# Altium schematic sheet Project_OLIA.SchDoc
size A2; SheetNumber: 1; SheetTotal: 1
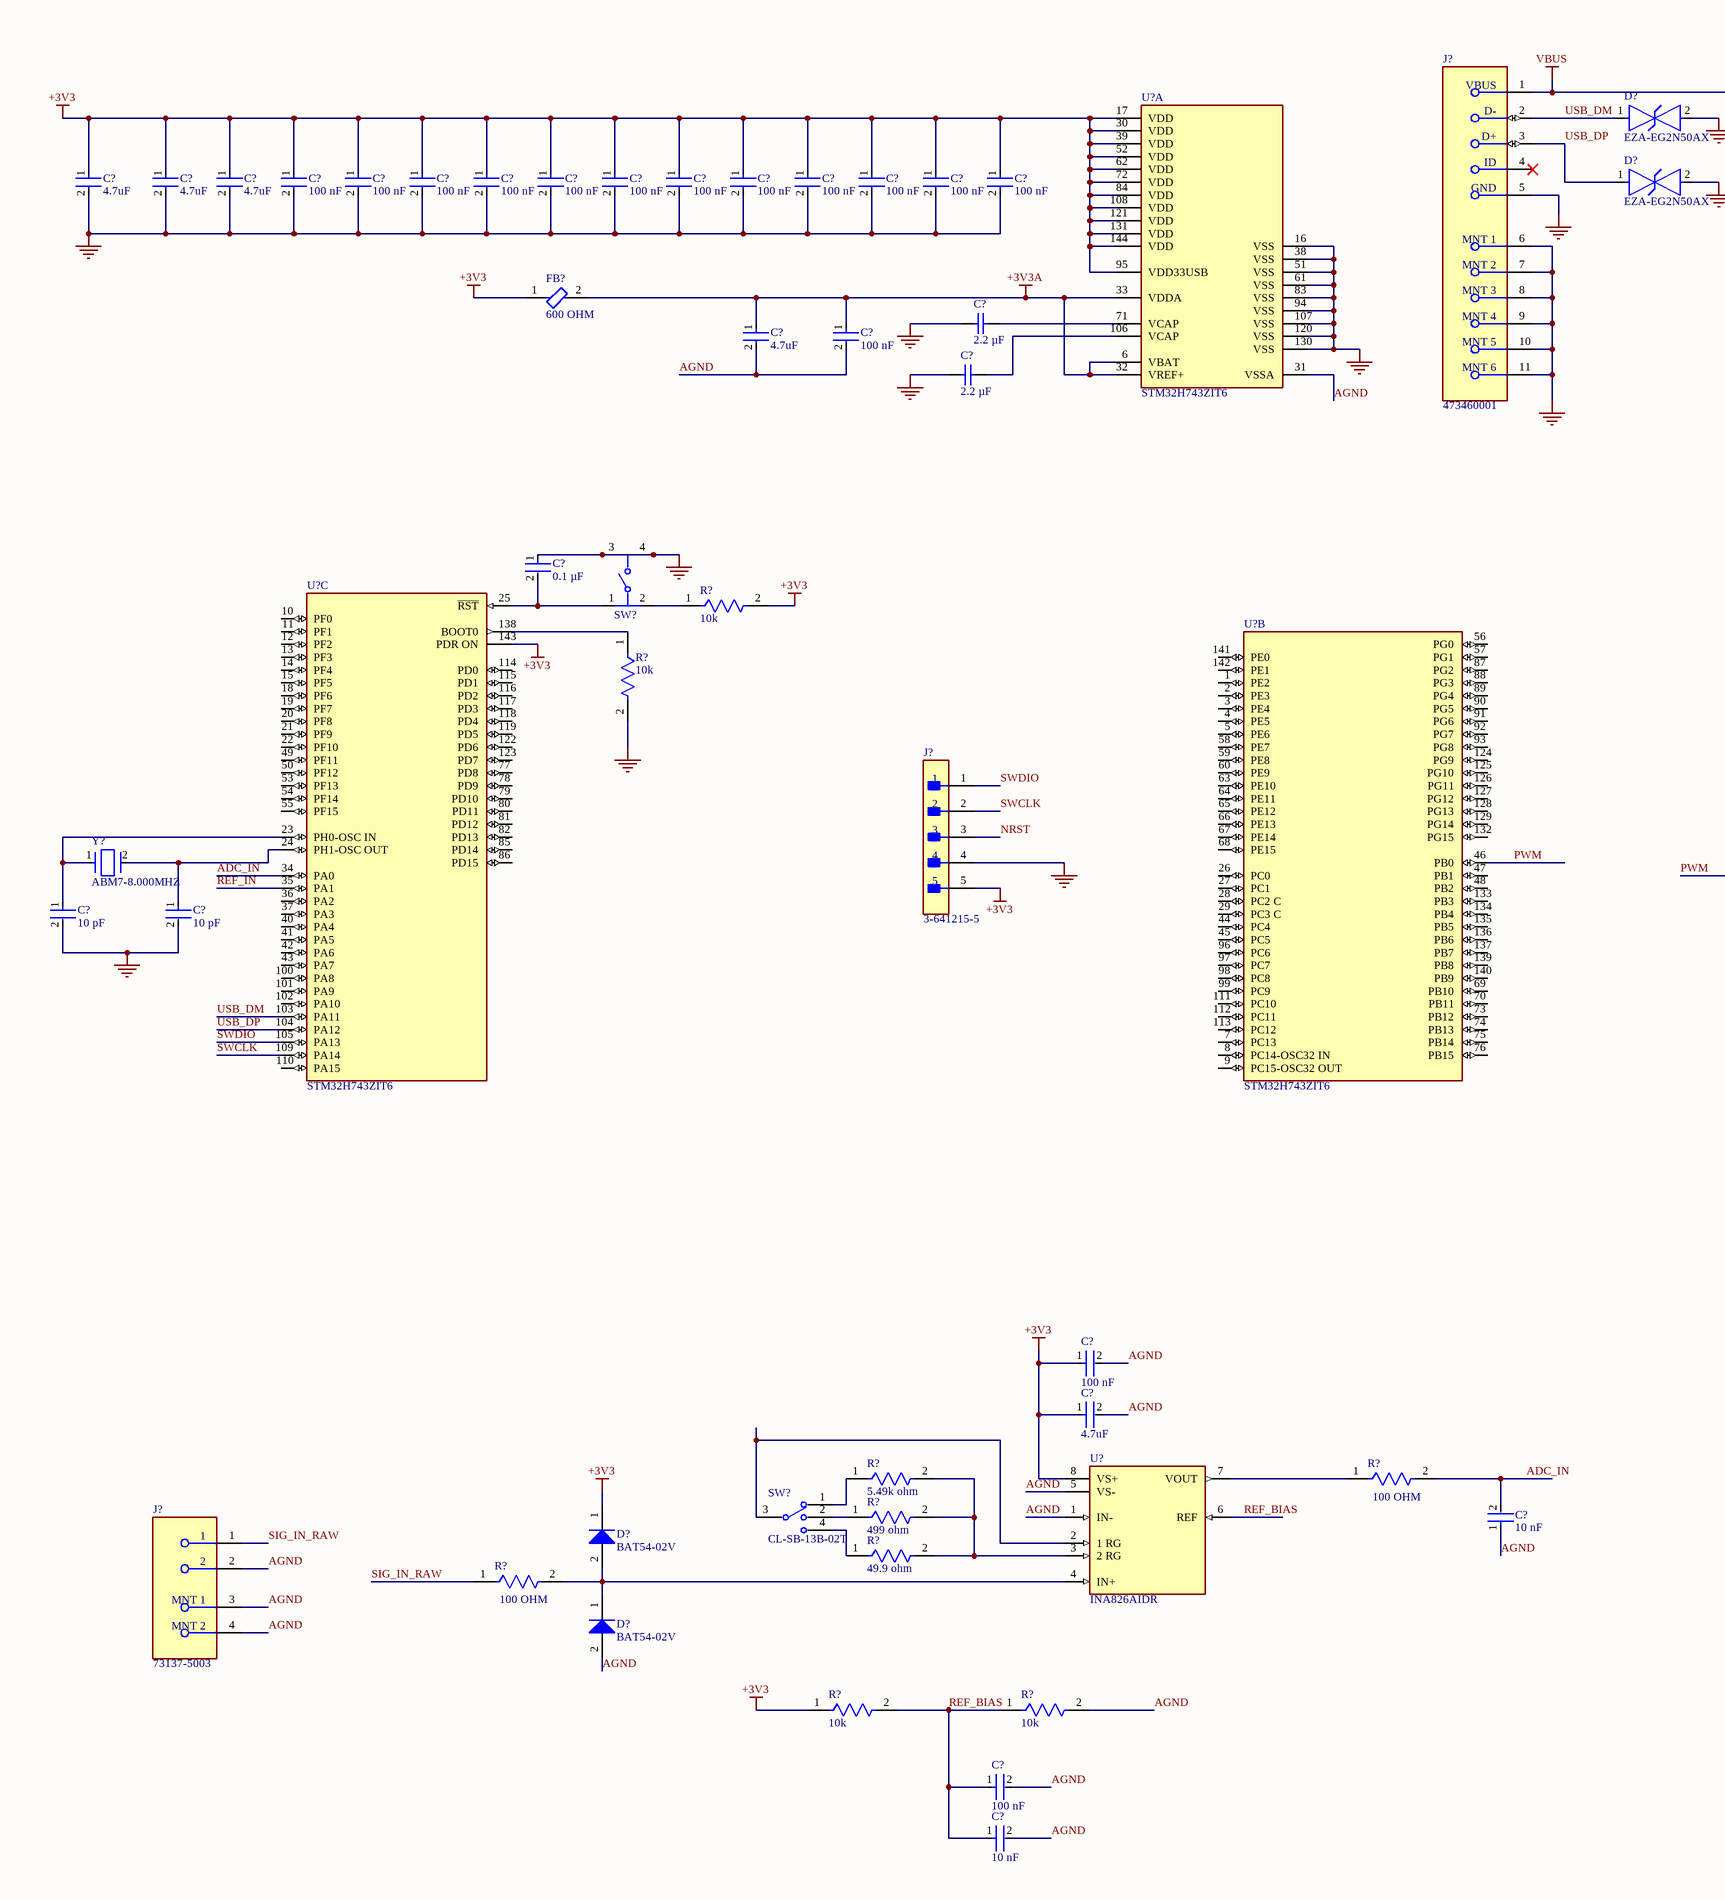
[diagram p0: Project_OLIA.SchDoc, left]
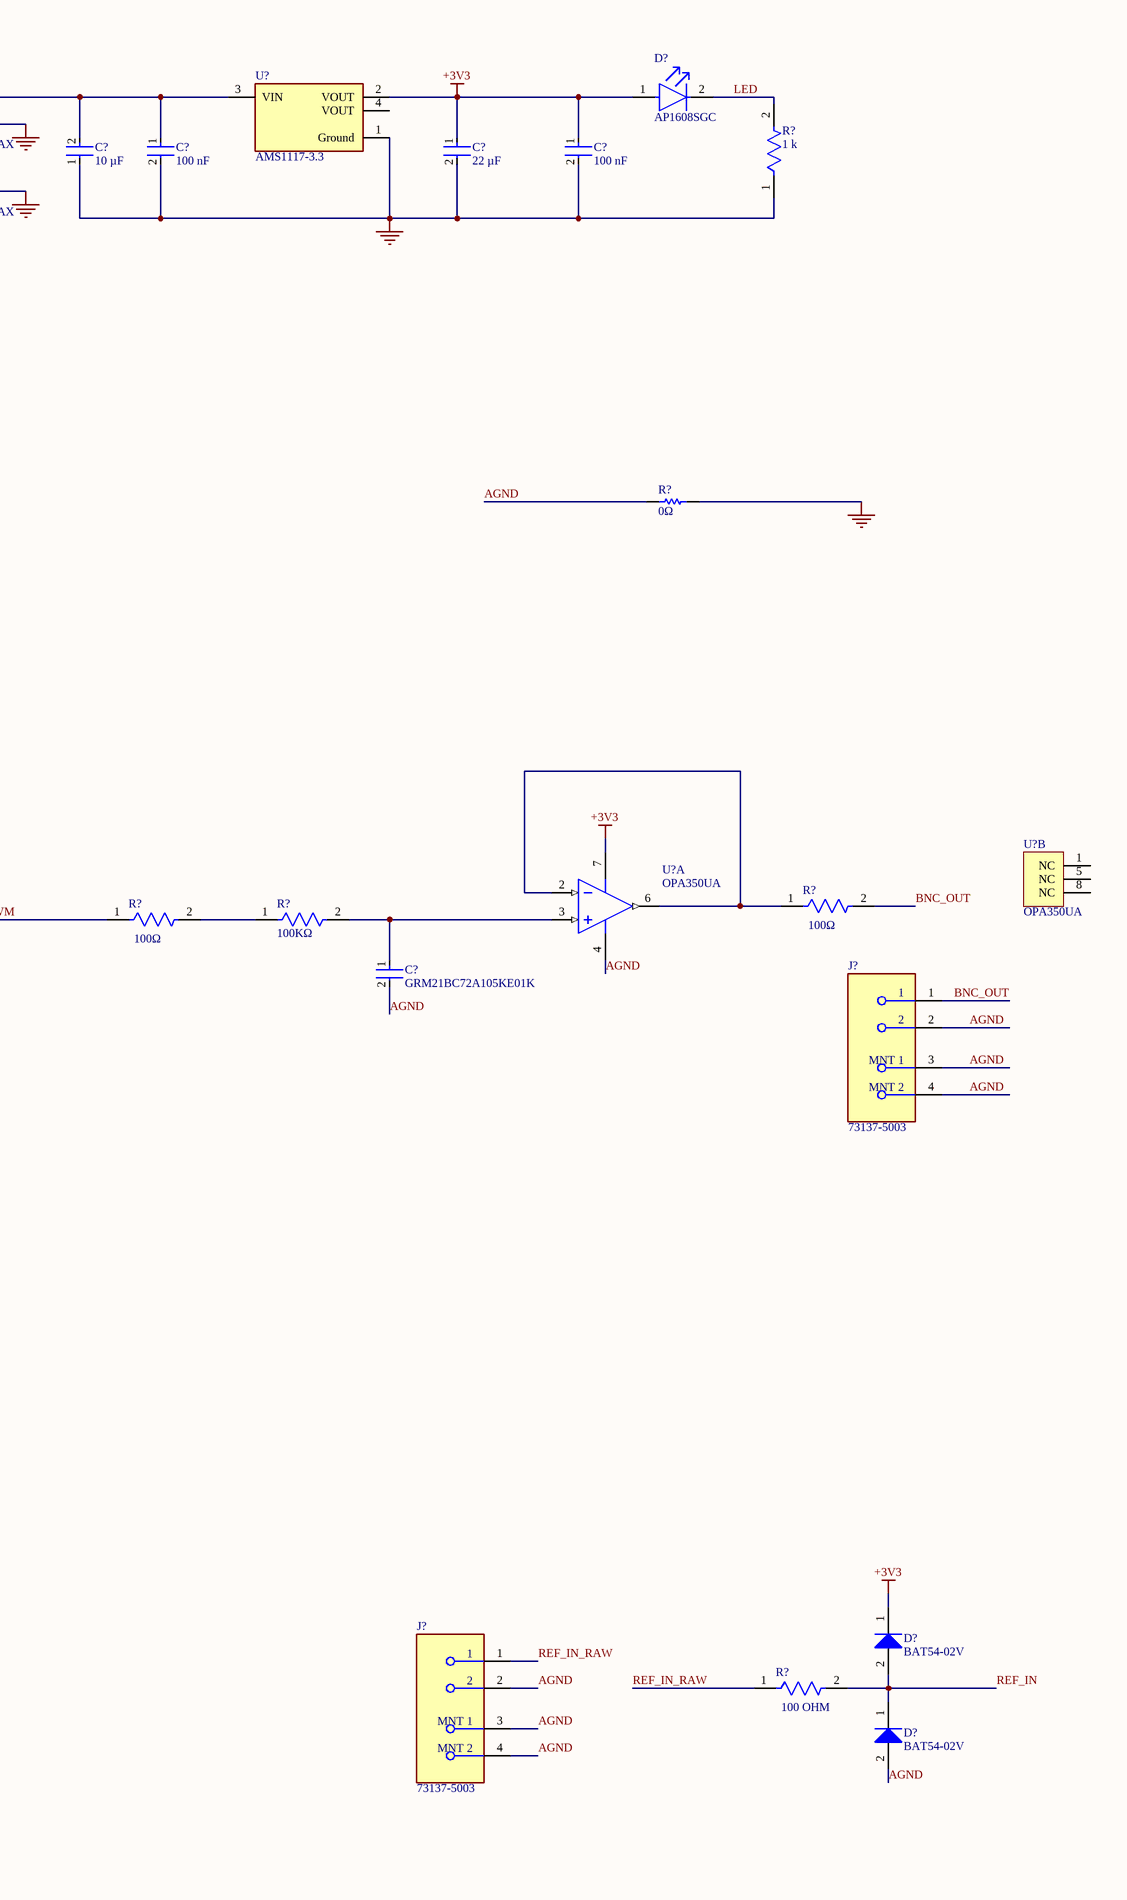
[diagram p1: Project_OLIA.SchDoc, right]

## Parts
(Parts that share a designator on the sheet are numbered #1, #2 ... from top to bottom, then left to right.)
C?#1  10 µF  [FP-GCM32E-0_3-IPC_B]
C?#2  100 nF  [FP-0603B104K500CT-IPC_C]
C?#3  22 µF  [FP-GRM188-0_2-IPC_B]
C?#4  100 nF  [FP-0603B104K500CT-IPC_C]
C?#5  4.7uF  [FP-GRM21B-0_15-IPC_A]
C?#6  4.7uF  [FP-GRM21B-0_15-IPC_A]
C?#7  4.7uF  [FP-GRM21B-0_15-IPC_A]
C?#8  100 nF  [FP-0603B104K500CT-IPC_C]
C?#9  100 nF  [FP-0603B104K500CT-IPC_C]
C?#10  100 nF  [FP-0603B104K500CT-IPC_C]
C?#11  100 nF  [FP-0603B104K500CT-IPC_C]
C?#12  100 nF  [FP-0603B104K500CT-IPC_C]
C?#13  100 nF  [FP-0603B104K500CT-IPC_C]
C?#14  100 nF  [FP-0603B104K500CT-IPC_C]
C?#15  100 nF  [FP-0603B104K500CT-IPC_C]
C?#16  100 nF  [FP-0603B104K500CT-IPC_C]
C?#17  100 nF  [FP-0603B104K500CT-IPC_C]
C?#18  100 nF  [FP-0603B104K500CT-IPC_C]
C?#19  100 nF  [FP-0603B104K500CT-IPC_C]
C?#20  4.7uF  [FP-GRM21B-0_15-IPC_A]
C?#21  100 nF  [FP-0603B104K500CT-IPC_C]
C?#22  2.2 µF  [CAPC0603X33X15ML03T05]
C?#23  2.2 µF  [CAPC0603X33X15ML03T05]
C?#24  0.1 µF  [FP-C0603C-CF-MFG]
C?#25  10 pF  [FP-GJM155-0_05-IPC_B]
C?#26  10 pF  [FP-GJM155-0_05-IPC_B]
C?#27  GRM21BC72A105KE01K  [FP-GRM21B-0_2-e0_2_0_7-MFG]
C?#28  100 nF  [FP-0603B104K500CT-IPC_C]
C?#29  4.7uF  [FP-GRM21B-0_15-IPC_A]
C?#30  10 nF  [FP-GRM033-0_03-IPC_B]
C?#31  100 nF  [FP-0603B104K500CT-IPC_C]
C?#32  10 nF  [FP-GRM033-0_03-IPC_B]
D?#1  AP1608SGC  [FP-AP1608SGC-MFG]
D?#2  EZA-EG2N50AX  [FP-EZAEG2N-MFG]
D?#3  EZA-EG2N50AX  [FP-EZAEG2N-MFG]
D?#4  BAT54-02V  [INF-SC79_V]
D?#5  BAT54-02V  [INF-SC79_V]
D?#6  BAT54-02V  [INF-SC79_V]
D?#7  BAT54-02V  [INF-SC79_V]
FB?  600 OHM  [FP-MMZ1608-0_6-MFG]
J?#1  473460001  [FP-473460001-MFG]
J?#2  3-641215-5  [FP-3-641215-5-MFG]
J?#3  73137-5003  [FP-73137-5003-MFG]
J?#4  73137-5003  [FP-73137-5003-MFG]
J?#5  73137-5003  [FP-73137-5003-MFG]
R?#1  1 k  [FP-RMCF0603-MFG]
R?#2  0Ω  [RESC1609X50X30LL10T20]
R?#3  10k  [FP-RC1005-IPC_B]
R?#4  10k  [FP-RC1005-IPC_B]
R?#5  100Ω  [FP-ERA1A-IPC_B]
R?#6  100Ω  [FP-ERA1A-IPC_B]
R?#7  100KΩ  [FP-AC0603-MFG]
R?#8  5.49k ohm  [FP-CRCW0805-e3-IPC_B]
R?#9  100 OHM  [FP-ERA1A-IPC_B]
R?#10  499 ohm  [FP-CRCW0603-e3-MFG]
R?#11  49.9 ohm  [FP-AC2512-MFG]
R?#12  100 OHM  [FP-ERA1A-IPC_B]
R?#13  100 OHM  [FP-ERA1A-IPC_B]
R?#14  10k  [FP-RC1005-IPC_B]
R?#15  10k  [FP-RC1005-IPC_B]
SW?#1  1-1977223-9  [FP-1-1977223-9-MFG]  (value not drawn)
SW?#2  CL-SB-13B-02T  [FP-CL-SB-13B-02T-MFG]
U?#1  AMS1117-3.3  [FP-AMS1117-IPC_C]
U?#2  STM32H743ZIT6  [FP-LQFP144-1A-MFG]  (part A of 3)
U?#3  STM32H743ZIT6  [FP-LQFP144-1A-MFG]  (part C of 3)
U?#4  STM32H743ZIT6  [FP-LQFP144-1A-MFG]  (part B of 3)
U?#5  OPA350UA  [D0008A_M]  (part B of 2)
U?#6  OPA350UA  [D0008A_M]  (part A of 2)
U?#7  INA826AIDR  [FP-D0008A-IPC_A]
Y?  ABM7-8.000MHZ  [FP-ABM7-MFG]

## Nets
+3V3: C?#3.1 C?#4.1 C?#5.1 C?#6.1 C?#7.1 C?#8.1 C?#9.1 C?#10.1 C?#11.1 C?#12.1 C?#13.1 C?#14.1 C?#15.1 C?#16.1 C?#17.1 C?#18.1 C?#19.1 C?#28.1 C?#29.1 D?#1.1(A) D?#4.1(K) D?#5.1(K) FB?.1 J?#2.5 R?#3.2 R?#14.1 U?#1.2(VOUT) U?#2.17(VDD) U?#2.30(VDD) U?#2.39(VDD) U?#2.52(VDD) U?#2.62(VDD) U?#2.72(VDD) U?#2.84(VDD) U?#2.95(VDD33USB) U?#2.108(VDD) U?#2.121(VDD) U?#2.131(VDD) U?#2.144(VDD) U?#3.143(PDR_ON) U?#6.7(V+) U?#7.8(VS+)
+3V3A: C?#20.1 C?#21.1 FB?.2 U?#2.6(VBAT) U?#2.32(VREF+) U?#2.33(VDDA)
GND: C?#1.1 C?#2.2 C?#3.2 C?#4.2 C?#5.2 C?#6.2 C?#7.2 C?#8.2 C?#9.2 C?#10.2 C?#11.2 C?#12.2 C?#13.2 C?#14.2 C?#15.2 C?#16.2 C?#17.2 C?#18.2 C?#19.2 C?#22.2 C?#23.1 C?#24.1 C?#25.2 C?#26.2 D?#2.2 D?#3.2 J?#1.5(GND) J?#1.6(MNT_1) J?#1.7(MNT_2) J?#1.8(MNT_3) J?#1.9(MNT_4) J?#1.10(MNT_5) J?#1.11(MNT_6) J?#2.4 R?#1.1 R?#2.2 R?#4.2 SW?#1.3 SW?#1.4 U?#1.1(Ground) U?#2.16(VSS) U?#2.38(VSS) U?#2.51(VSS) U?#2.61(VSS) U?#2.83(VSS) U?#2.94(VSS) U?#2.107(VSS) U?#2.120(VSS) U?#2.130(VSS)
VBUS: C?#1.2 C?#2.1 J?#1.1(VBUS) U?#1.3(VIN)
ADC_IN: C?#30.2 R?#9.2 U?#3.34(PA0)
AGND: C?#20.2 C?#21.2 C?#27.2 C?#28.2 C?#29.2 C?#30.1 C?#31.2 C?#32.2 D?#6.2(A) D?#7.2(A) J?#3.2 J?#3.3(MNT_1) J?#3.4(MNT_2) J?#4.2 J?#4.3(MNT_1) J?#4.4(MNT_2) J?#5.2 J?#5.3(MNT_1) J?#5.4(MNT_2) R?#2.1 R?#15.2 U?#2.31(VSSA) U?#6.4(V-) U?#7.1(IN-) U?#7.5(VS-)
BNC_OUT: J?#3.1 R?#5.2
LED: D?#1.2(C) R?#1.2
NRST: J?#2.3
PWM: R?#6.1 U?#4.46(PB0)
REF_BIAS: C?#31.1 C?#32.1 R?#14.2 R?#15.1 U?#7.6(REF)
REF_IN: D?#5.2(A) D?#7.1(K) R?#13.2 U?#3.35(PA1)
REF_IN_RAW: J?#5.1 R?#13.1
SIG_IN_RAW: J?#4.1 R?#12.1
SWCLK: J?#2.2 U?#3.109(PA14)
SWDIO: J?#2.1 U?#3.105(PA13)
USB_DM: D?#2.1 J?#1.2(D-) U?#3.103(PA11)
USB_DP: D?#3.1 J?#1.3(D+) U?#3.104(PA12)
NetC?#22_1: C?#22.1 U?#2.71(VCAP)
NetC?#23_2: C?#23.2 U?#2.106(VCAP)
NetC?#24_2: C?#24.2 SW?#1.1 U?#3.25(~{RST})
NetC?#25_1: C?#25.1 U?#3.23(PH0-OSC_IN) Y?.1
NetC?#26_1: C?#26.1 U?#3.24(PH1-OSC_OUT) Y?.2
NetC?#27_1: C?#27.1 R?#7.2 U?#6.3(IN+)
NetD?#4_2: D?#4.2(A) D?#6.1(K) R?#12.2 U?#7.4(IN+)
NetR?#3_1: R?#3.1 SW?#1.2
NetR?#4_1: R?#4.1 U?#3.138(BOOT0)
NetR?#5_1: R?#5.1 U?#6.2(IN-) U?#6.6(OUT)
NetR?#6_2: R?#6.2 R?#7.1
NetR?#8_1: R?#8.1 SW?#2.1
NetR?#8_2: R?#8.2 R?#10.2 R?#11.2 U?#7.3(2_RG)
NetR?#9_1: R?#9.1 U?#7.7(VOUT)
NetR?#10_1: R?#10.1 SW?#2.2
NetR?#11_1: R?#11.1 SW?#2.4
NetSW?#2_3: SW?#2.3(C) U?#7.2(1_RG)

Not connected (* = marked no-connect by the designer): J?#1 4(ID)*; U?#1 4(VOUT); U?#3 10(PF0) 11(PF1) 12(PF2) 13(PF3) 14(PF4) 15(PF5) 18(PF6) 19(PF7) 20(PF8) 21(PF9) 22(PF10) 36(PA2) 37(PA3) 40(PA4) 41(PA5) 42(PA6) 43(PA7) 49(PF11) 50(PF12) 53(PF13) 54(PF14) 55(PF15) 77(PD8) 78(PD9) 79(PD10) 80(PD11) 81(PD12) 82(PD13) 85(PD14) 86(PD15) 100(PA8) 101(PA9) 102(PA10) 110(PA15) 114(PD0) 115(PD1) 116(PD2) 117(PD3) 118(PD4) 119(PD5) 122(PD6) 123(PD7); U?#4 1(PE2) 2(PE3) 3(PE4) 4(PE5) 5(PE6) 7(PC13) 8(PC14-OSC32_IN) 9(PC15-OSC32_OUT) 26(PC0) 27(PC1) 28(PC2_C) 29(PC3_C) 44(PC4) 45(PC5) 47(PB1) 48(PB2) 56(PG0) 57(PG1) 58(PE7) 59(PE8) 60(PE9) 63(PE10) 64(PE11) 65(PE12) 66(PE13) 67(PE14) 68(PE15) 69(PB10) 70(PB11) 73(PB12) 74(PB13) 75(PB14) 76(PB15) 87(PG2) 88(PG3) 89(PG4) 90(PG5) 91(PG6) 92(PG7) 93(PG8) 96(PC6) 97(PC7) 98(PC8) 99(PC9) 111(PC10) 112(PC11) 113(PC12) 124(PG9) 125(PG10) 126(PG11) 127(PG12) 128(PG13) 129(PG14) 132(PG15) 133(PB3) 134(PB4) 135(PB5) 136(PB6) 137(PB7) 139(PB8) 140(PB9) 141(PE0) 142(PE1); U?#5 1(NC) 5(NC) 8(NC)

## Library data of the parts
C?#1 = CMP-2000-06321-2: Ceramic Capacitor for Automotive 10uF ±10% 25VDC X7R 1210 Embossed T/R; Voltage: 25V; Thickness: 0.106inch; Min Operating Temperature: -55°C; Max Operating Temperature: 125°C; Ratings: AEC-Q200; Packaging: Tape and Reel; Package Quantity: 1; Width: 2.5mm; Mount: Surface Mount; Height: 2.5mm; Case Code (Imperial): 1210; Length: 3.2mm; Capacitance: 10uF; Tolerance: 10%; Lead Free: Lead Free; Dielectric: X7R; REACH SVHC: No SVHC; Case/Package: 1210; Voltage Rating: 25V; Depth: 2.5mm; Case Code (Metric): 3225; Termination: SMD/SMT; Voltage Rating (DC): 25V; Radiation Hardening: No
C?#2 C?#4 C?#8-C?#19 C?#21 C?#28 C?#31 = CMP-45632-000007-1: CAP CER 0.1UF 50V X7R 0603; Tolerance: 10%; Capacitance: 100nF; Radiation Hardening: No; Depth: 0.8mm; Length: 1.6mm; Voltage Rating: 50V; Dielectric: X7R; Case/Package: 0603; RoHS Compliant: Yes; Case Code (Metric): 1608; Voltage Rating (DC): 50V; Min Operating Temperature: -55°C; Series: -; Max Operating Temperature: 125°C; Lead Free: Lead Free; Case Code (Imperial): 0603; Packaging: Tape and Reel
C?#3 = CMP-06035-000956-1: Chip Multilayer Ceramic Capacitors for General Purpose, 0603, 22uF, X5R, 15%, 20%, 10V; Tolerance: 20%; Voltage Rating (DC): 10V; Length: 1.6mm; Thickness: 800um; Width: 800um; Dielectric: X5R; Capacitance: 22uF
C?#5-C?#7 C?#20 C?#29 = CMP-06035-033280-1: Chip Multilayer Ceramic Capacitors for General Purpose, 0805, 4.7uF, X6S, 22%, 20%, 35V; Length: 2mm; Dielectric: X6S; Width: 1.25mm; Capacitance: 4.7uF; Case/Package: 0805; Tolerance: 20%; Voltage Rating (DC): 35V; Thickness: 1.25mm
C?#22 C?#23 = CMP-2010-00434-1: Manufacturer: AVX Interconnect / Elco; Part Number: 0201ZD225MAT2A
C?#24 = CMP-2006-03061-2: CAP CER 0.1UF 50V X7R 0603; Manufacturer: KEMET; Manufacturer Part Number: C0603C104K5RACTU; Tolerance: 0.1; Temperature Coefficient: 30ppm/°C; Material: Ceramic; Automotive Grade: Grade 1; Value: 0.10 μF; Temperature: -55°C to +125°C; RoHS: TRUE; Temperature Range High: +125°C; Lead Free: Yes; Octopart: https://octopart.com/c0603c104k5ractu-kemet-139244; Digikey Description: CAP CER 0.1UF 50V X7R 0603; Category: Cap; Package: C0603C-CF; ComponentLink2Description: Datasheet; Temperature Range Low: -55°C; Device Class L1: Passive Components; Voltage Rating: 50 V; Automotive: Yes; Device Class L3: Ceramic Capacitors; ComponentLink2URL: https://api.kemet.com/component-edge/download/datasheet/C0603C100J5GACAUTO.pdf; Capacitance: 0.10 μF; Device Class L2: Capacitors; Temperature Characteristic: X7R; Height: 0.87mm
C?#25 C?#26 = CMP-2008-03796-2: Multi-Layer Ceramic Capacitor 10pF C0G  ±2% 0402 Paper T/R; Voltage Rating: 50V; Thickness: 0.022inch; Case Code (Imperial): 0402; Height: 0.5mm; Min Operating Temperature: -55°C; Lead Free: Lead Free; Case Code (Metric): 1005; Mount: Surface Mount; Voltage Rating (DC): 50V; Width: 0.5mm; Max Operating Temperature: 125°C; Case/Package: 0402; Capacitance: 10pF; Packaging: Tape and Reel; Depth: 0.5mm; Package Quantity: 1; Termination: SMD/SMT; Length: 1mm; Dielectric: C0G; Tolerance: 2%; Radiation Hardening: No
C?#27 = CMP-06035-022504-1: Chip Multilayer Ceramic Capacitors for General Purpose, 0805, 1.0uF, X7S, 22%, 10%, 100V; Capacitance: 1uF; Width: 1.25mm; Dielectric: X7S; Length: 2mm; Thickness: 1.25mm; Voltage Rating (DC): 100V; Tolerance: 10%
C?#30 C?#32 = CMP-06035-052966-1: Chip Multilayer Ceramic Capacitors for General Purpose, 0201, 10000pF, X5R, 15%, 10%, 6.3V
D?#1 = CMP-44529-000023-1: Standard LEDs - SMD GREEN WATER CLEAR; Luminous Intensity: 15mcd; Wavelength: 568nm; Forward Voltage: 2.2V; Forward Current: 20mA; Viewing Angle: 120°; Min Operating Temperature: -40°C; Mount: Surface Mount; Case/Package: 0603; Package Quantity: 2000; Lens Style: Clear; Illumination Color: Green; Packaging: Tape and Reel; Color: Green; Lead Free: Lead Free; Lens Color: Clear; Max Operating Temperature: 85°C
D?#2 D?#3 = CMP-00287-77741802-1: EZA-EG2N50AX Esd Suppressor, 50V, 0402 Rohs Compliant: Yes; Direction: Bidirectional; Capacitance: 50fF; Reverse Standoff Voltage: 30V; Case/Package: 0402; Min Operating Temperature: -55°C; Height: 430µm; RoHS: Non-Compliant; Lifecycle Status: Production; Max Operating Temperature: 125°C; Schedule B: 8536300000, 8536300000
D?#4-D?#7 = CMP-1182-00001-1: Silicon Schottky Diode, SC79, Reel, Green; Manufacturer: Infineon; Green: TRUE; ComponentLink3Description: Package Specification; ComponentLink2Description: Datasheet; ComponentLink1Description: Manufacturer URL; PackageDescription: 2-Pin Semiconductor Package, 0.8 x 1.2 mm Body; RevisionNote: Re-Activated Devices; PartNumber: BAT54-02V; ComponentLink3URL: http://www.infineon.com/dgdl/SC79-Package_Overview.pdf?folderId=db3a30431936bc4b011951fbddb03b15&fileId=db3a30431936bc4b01195226fe583b41; PackageReference: SC79; ComponentLink1URL: http://www.infineon.com/; ComponentLink2URL: http://www.infineon.com/dgdl/bat54series.pdf?folderId=db3a30431400ef68011425f1ca2505e3&fileId=db3a304314dca3890115190b74210ea6; Mounting Technology: Surface Mount; Halogen-free: FALSE
FB? = CMP-08257-000287-1: Signal Line Ferrite Bead 600 Ω 100MHz 500mA DCR 400mΩ AEC-Q200 SMD 0603; Impedance: 600R; Number of Lines: 1; DC Resistance (DCR): 400mR; Tolerance: 25%; Package Quantity: 1; RoHS Compliant: Yes; Case/Package: 0603; Width: 0.031inch; Test Frequency: 100MHz; Length: 0.063inch; Weight: 7.1E-05oz; Packaging: Tape and Reel; Max Current Rating: 500mA; Min Operating Temperature: -55°C; Ratings: AEC-Q200; Max Operating Temperature: 125°C; Termination: SMD/SMT; Case Code (Metric): 1608; Mount: Surface Mount; Height: 0.03inch; Case Code (Imperial): 0603; Max DC Current: 500mA
J?#1 = CMP-2000-05246-2: CONN RCPT USB2.0 MICRO B SMD R/A; Manufacturer: Molex; Conn Orientation: Right Angle; Is Female: yes; Shielding: true; Pitch: 0.65mm; Number Of Contacts: 5; Voltage Rating: 30V; Current Rating: 1.8A; Device Class L2: USB Connectors; Digikey Description: CONN RCPT USB2.0 MICRO B SMD R/A; Height: 2.945mm; RoHS: TRUE; ComponentLink2Description: Datasheet; Octopart: https://octopart.com/47346-0001-molex-7164928; Automotive: No; Package: 0; Category: Conn; Device Class L1: Connectors; Usb Standard: USB 2.0; Temperature: -30°C to +85°C; Temperature Range Low: -30°C; Footprint Url: https://www.molex.com/pdm_docs/sd/473460001_sd.pdf; ComponentLink2URL: https://www.molex.com/webdocs/datasheets/pdf/en-us/0473460001_IO_CONNECTORS.pdf; Lead Free: Yes; Manufacturer Part Number: 473460001; Contact Material: Gold,Nickel; Temperature Range High: +85°C; Device Class L3: unset
J?#2 = CMP-03369-000062-1: CONN HEADER VERT 5POS 2.54MM; Manufacturer: TE Connectivity; Voltage Rating: 250V; Conn Gender: Male; Conn Orientation: Vertical; Current Rating: 5A; Number Of Contacts: 5; Device Class L3: unset; Package: 3-641215-5; Digikey Description: CONN HEADER VERT 5POS 2.54MM; Device Class L1: Connectors; Temperature: -55°C to +105°C; Manufacturer Part Number: 3-641215-5; Pitch: 2.54mm; RoHS: TRUE; ComponentLink2Description: Datasheet; Footprint Url: https://www.te.com/commerce/DocumentDelivery/DDEController?Action=showdoc&DocId=Customer+Drawing%7F641215%7FZ4%7Fpdf%7FEnglish%7FENG_CD_641215_Z4.pdf%7F3-641215-5; Height: 0.415inch; Temperature Range High: +105°C; Mouser Description: Headers & Wire Housings FRICTION LCK HDR 5P Straight Post gold; Automotive: No; Number Of Rows: 1; Device Class L2: Headers and Wire Housings; Contact Material: Gold,Nickel; Temperature Range Low: -55°C; ComponentLink2URL: https://www.te.com/commerce/DocumentDelivery/DDEController?Action=showdoc&DocId=Specification+Or+Standard%7F108-1050%7FL%7Fpdf%7FEnglish%7FENG_SS_108-1050_L.pdf%7F3-641215-5; Octopart: https://octopart.com/3-641215-5-te+connectivity-40938285; Category: Conn; Lead Free: Yes
J?#3-J?#5 = CMP-00257-00776508-1: 73137-5003 Connector BNC Female 0Hz To 2GHz 50 Ohm Solder Right Angle Through Hole Gold Tray; NexarPartId: 776508; Manufacturer Lifecycle Status: ACTIVE; Body Plating: Nickel; Polarity: Normal; Connector Type: PCB; Number of Contacts: 1; Impedance: 50Ω; Body Material: PBT, Polybutylene; Voltage Rating: 500V; Dielectric Material: Polypropylene; Min Operating Temperature: -20°C; Orientation: Right Angle, Straight; Termination: Solder; Gender: Female; RoHS: Compliant; REACH SVHC: No SVHC; Lifecycle Status: Production; Country of Origin: US; Contact Plating: Gold; Depth: 14.76mm; Lead Free: Lead Free; Mount: Through Hole; Length: 35.18mm; Max Operating Temperature: 70°C; Frequency: 2GHz; Radiation Hardening: No; Height: 13.2mm; Plating: Nickel; Contact Material: Bronze, Gold, Nickel, Tin; Insulation Material: Polyester; Halogen Free: Low Halogen
R?#1 = CMP-26527-000152-1: 1kΩ ±1% 0.1W 0603 Thick Film Chip Resistor AEC-Q200 compliant; Resistance: 1kR; Max Power Dissipation: 100mW; Temperature Coefficient: 100ppm/°C; Packaging: Tape and Reel; Mount: Surface Mount; RoHS Compliant: Yes; Construction: Rectangular; Width: 0.031inch; Case Code (Imperial): 0603; Contact Plating: Tin; Length: 1.55mm; Lead Free: Lead Free; Case Code (Metric): 1608; Size Code: 0603; Depth: 0.8mm; Series: RMCF; Power Rating: 100mW; Height: 0.022inch; Case/Package: 0603; Tolerance: 1%; Min Operating Temperature: -55°C; Military Standard: Not; Features: Automotive AEC-Q200; Max Operating Temperature: 155°C; Number of Terminations: 2; Radiation Hardening: No; Resistor Type: Thick Film
R?#2 = CMP-1012-00001-2: Manufacturer: Vishay Dale; Part Number: CRCW06030000Z0EC
R?#3 R?#4 R?#14 R?#15 = CMP-13261-004522-1: Res Thick Film 0402 10kΩ 1% 0.063W ±100ppm/°C Molded SMD T/R; Max Power Dissipation: 63mW; Resistance: 10kR; Power Rating: 62.5mW; Package Quantity: 1; Depth: 0.5mm; Radiation Hardening: No; Features: Moisture Resistant; Max Operating Temperature: 155°C; Case Code (Metric): 1005; Military Standard: Not; Case/Package: 0402; Width: 0.02inch; Contact Plating: Tin; Mount: Surface Mount; Packaging: Tape and Reel; Height: 0.016inch; Case Code (Imperial): 0402; Number of Terminations: 2; Composition: Thick Film; Temperature Coefficient: 100ppm/°C; Min Operating Temperature: -55°C; Tolerance: 1%; Length: 1mm
R?#5 R?#6 R?#9 R?#12 R?#13 = CMP-05422-000095-1: RES SMD 100 OHM 0.1% 1/20W 0201; Max Power Dissipation: 50mW; Resistance: 100R; Temperature Coefficient: 25ppm/°C; Lead Free: Lead Free; Width: 0.012inch; Max Operating Temperature: 155°C; Features: Automotive AEC-Q200; Packaging: Tape and Reel; Length: 0.024inch; Number of Terminations: 2; Case Code (Imperial): 0201; Case/Package: 0201; Case Code (Metric): 0603; Tolerance: 0.1%; Min Operating Temperature: -55°C; Height: 0.009inch; Resistor Type: Thin Film
R?#7 = CMP-03412-022575-2: RES 100KΩ 1.00% 0.1W 0603; Tolerance: 1%; Resistance: 100kR; RoHS Compliant: Yes; Case/Package: 0603
R?#8 = CMP-2001-04029-2: RES Thick Film, 5.49kΩ, 1%, 0.125W, 100ppm/°C, 0805; Voltage Rating: 150V; Power Rating: 125mW; Resistance: 5.49kR; Number of Terminations: 2; Packaging: Tape and Reel; Case/Package: 0805; Width: 0.049inch; Case Code (Imperial): 0805; Case Code (Metric): 2012; Radiation Hardening: No; Length: 2mm; Depth: 1.25mm; Tolerance: 1%; Features: Automotive AEC-Q200; Weight: 0.000194oz; Max Operating Temperature: 155°C; Termination: SMD/SMT; Composition: Thick Film; Military Standard: Not; Max Power Dissipation: 125mW; Temperature Coefficient: 100ppm/°C; Height: 0.45mm; Min Operating Temperature: -55°C; Contact Plating: Tin; Package Quantity: 10
R?#10 = CMP-2000-03390-2: RES Thick Film, 499Ω, 1%, 0.1W, 100ppm/°C, 0603; Voltage Rating (DC): 75V; Power Rating: 100mW; Resistance: 499R; Case/Package: 0603; Package Quantity: 5000; Military Standard: Not; Length: 1.55mm; Width: 0.85mm; Number of Terminations: 2; Lead Free: Lead Free; Height: 0.45mm; Weight: 7.1E-05oz; Composition: Thick Film; Radiation Hardening: No; Max Operating Temperature: 155°C; Tolerance: 1%; Working Voltage: 75V; Temperature Coefficient: 100ppm/°C; Packaging: Tape and Reel; Contact Plating: Tin; Termination: SMD/SMT; Depth: 0.85mm; Case Code (Metric): 1608; Min Operating Temperature: -55°C; Mount: Surface Mount; Case Code (Imperial): 0603; Voltage Rating: 75V
R?#11 = CMP-03412-029457-1: RES SMD 49.9 OHM 1% 1W 2512; Manufacturer: Yageo; Manufacturer Part Number: AC2512FK-0749R9L; Automotive Grade: Grade 0; Voltage Rating: 200V; Resistance: 49.9Ω; Tolerance: 0.01; Value: 49.9Ω; Category: Res; Power Rating: 1W; ComponentLink2Description: Datasheet; Device Class L2: Resistors; ComponentLink2URL: http://www.yageo.com/documents/recent/PYu-AC_51_RoHS_L_6.pdf; Footprint Url: http://www.yageo.com/exep/pages/download/literatures/PYu-R_Mount_10.pdf; Lead Free: Yes; Ipc Land Pattern Name: RESC635310X55; Automotive: Yes; Device Class L3: Chip SMD Resistors; Composition: Thick Film; Series: AC; Temperature: -55°C to +155°C; Temperature Range Low: -55°C; Octopart: https://octopart.com/ac2512fk-0749r9l-yageo-71370116; Package: AC2512; RoHS: TRUE; Digikey Description: RES SMD 49.9 OHM 1% 1W 2512; Device Class L1: Passive Components; Height: 0.65mm; Temperature Range High: +155°C
SW?#1 = CMP-03407-000015-1: SWITCH TACTILE SPST-NO 0.05A 24V; Current Rating: 50mA; Operating Force: 2.55N; Throw Configuration: SPST; Actuator Material: Nylon; Actuator Color: Pink; Mechanical Life: 1000000Cycles; Illumination Type: Non-Illuminated; Switch Travel: 0.25mm; Switch Function: Off-Mom; Actuator Type: Standard; RoHS Compliant: Yes; Min Operating Temperature: -40°C; Contact Plating: Silver; Max Operating Temperature: 105°C; Contact Material: Stainless Steel; Max Current Rating: 50mA; Series: FSMJSMA; Length: 6mm; Radiation Hardening: No; Depth: 10mm; Max Voltage Rating (DC): 24V; Orientation: Straight; Termination: Gull Wing; Voltage Rating (DC): 24V; Packaging: Bulk; Mount: Surface Mount; Case/Package: SMD/SMT; Package Quantity: 750
SW?#2 = CMP-08360-77011255-1: CL-SB-13B-02T Switch Slide ON-ON-ON SP3T Top 200mA 12VDC 10000Cycles Gullwing T/R; Actuator Length: 2mm; Contact Style: Non-Shorting; Electrical Life: 10kcycles; Contact Resistance: 70mΩ; Voltage Rating (DC): 12V; Actuator Material: Nylon, Polyamide; RoHS: Compliant; Contact Current Rating: 200mA; Packaging: Tape & Reel (TR); Termination: Gull Wing; Orientation: Vertical; Lead Free: Lead Free; Current Rating: 200mA; Mount: Surface Mount; Height: 6.1mm; Switch Travel: 2mm; Switch Function: On-On-On; Contact Plating: Gold; Min Operating Temperature: -40°C; Throw Configuration: SP3T; Life (Cycles): 10kcycles; NexarPartId: 77011255; Contact Material: Copper; Max Operating Temperature: 85°C
U?#1 = CMP-209535-000001-1: LDO Voltage Regulators 1A, 3.3V; Manufacturer: Advanced Monolithic Systems; Dropout Voltage: 1.1V; Output Type: Fixed; Nominal Supply Current: 5mA; Max Power Dissipation: 1.2W; Max Supply Voltage: 15V; Number Of Outputs: 1; Standoff Height: 0.64mm; Max Junction Temp: +125°C; Height: 1.8mm; Package: AMS1117; Device Class L2: Power Management ICs; ComponentLink2Description: Datasheet; ComponentLink2URL: http://www.advanced-monolithic.com/pdf/ds1117.pdf; Category: IC; RoHS: TRUE; Automotive: No; Device Class L1: Integrated Circuits (ICs); Output Current: 1A; Device Class L3: Voltage Regulators - Linear; Temperature: -40°C to +125°C; Output Voltage: 3.3V; Manufacturer Part Number: AMS1117-3.3; Temperature Range Low: -40°C; Octopart: https://octopart.com/ams1117-3.3-advanced+monolithic+systems-25899300; Lead Free: Yes; Ipc Land Pattern Name: SOT229P700X180-4; Temperature Range High: +125°C
U?#2-U?#4 = CMP-12105-000003-1: IC MCU 32BIT 2MB FLASH 144LQFP; Manufacturer: STMicroelectronics; Number Of I2C Channels: 4; Number Of A/D Converters: 2; Standoff Height: 0.05mm; Interface: I2C,SPI,UART,USART,EBI/EMI,CAN,USB,LIN,IrDA,Other; Max Supply Voltage: 3.6V; Number Of Adc Channels: 36; Ram Size: 1MBytes; Number Of Cores: 1; Frequency: 400MHz; Data Bus Width: 32bits; Core Architecture: ARM Cortex-M7; Memory Size: 2MBytes; Number Of Timers/Counters: 22; Min Supply Voltage: 1.62V; Number Of Spi Channels: 6; Max Junction Temp: +125°C; Number Of I/Os: 114; Digikey Description: IC MCU 32BIT 2MB FLASH 144LQFP; Device Class L2: Embedded Processors and Controllers; Number Of Usb Channels: 2; ComponentLink2Description: Datasheet; Ipc Land Pattern Name: QFP50P2200X2200X160-144; Category: IC; Lead Free: Yes; Temperature Range High: +85°C; Mouser Description: MCU 32-Bit STM32 ARM Cortex M7 RISC 2MB Flash 1.8V/2.5V/3.3V 144-Pin LQFP Tray; RoHS: TRUE; Ambient Temperature Range Low: -40°C; Temperature Range Low: -40°C; ComponentLink2URL: https://www.st.com/resource/en/datasheet/stm32h743zi.pdf; Ambient Temperature Range High: +85°C; Octopart: https://octopart.com/stm32h743zit6-stmicroelectronics-76372529; Number Of Pwm Channels: 2; Height: 1.6mm; Manufacturer Part Number: STM32H743ZIT6; Device Class L3: Microcontrollers; Device Class L1: Integrated Circuits (ICs); Automotive: No; Memory Type: FLASH; Number Of Uart Channels: 4; Package: LQFP144-1A; Temperature: -40°C to +85°C
U?#5 U?#6 = CMP-0271-00145-3: High-Speed, Single-Supply, Rail-to-Rail Operational Amplifier MicroAmplifier(TM) Series, 2.7 to 5.5 V, -40 to 85 degC, 8-pin SOIC (D8), Green (RoHS & no Sb/Br); Manufacturer: Texas Instruments; IIB(Max)(pA): 10; Iq per channel(Max)(mA): 8.5; Number of Channels: 1; CMRR(Min)(dB): 66; Slew Rate(Typ)(V/us): 22; Total Supply Voltage(Max)(+5V is 5, +/-5V is 10): 5.5; Sub Family: Low Input Bias Current Amp (<=10pA), Low Offset Voltage Amplifier (<=500uV), Low Supply Voltage Amplifier (<=2.7V), Precision Amplifier; Offset Drift(Typ)(uV/C): 4; Total Supply Voltage(Min)(+5V is 5, +/-5V is 10): 2.7; Vn at 1kHz(Typ)(nV/rtHz): 18; PackageReference: D0008A; PackageDescription: 8-Pin Plastic Small Outline, Body 4.9 x 3.9 mm, Pitch 1.27 mm; Code_JEDEC: MS-012; Eco-Plan: Green (RoHS & no Sb/Br); DatasheetVersion: SBOS099C; Vio (25C)(Max)(mV): 1; ComponentLink1URL: http://www.ti.com/; ComponentLink3URL: http://www.ti.com/litv/pdf/msoi002j; PackageVersion: 4040047-3/M, 06/2011; ComponentLink3Description: Package Specification; ComponentLink2URL: http://www.ti.com/general/docs/lit/getliterature.tsp?genericPartNumber=OPA350&fileType=pdf; PartNumber: OPA350UA; ComponentLink2Description: Datasheet; ComponentLink1Description: Manufacturer URL; Mounting Technology: Surface Mount
U?#7 = CMP-0944-00042-3: IC INST AMP 1 CIRCUIT 8SOIC; Number of Circuits: 1; Common Mode Rejection Ratio: 84dB; Power Supply Rejection Ratio (PSRR): 100dB; Input Voltage Noise Density: 18nV/sqrt Hz; Input Resistance: 100kR; Output Current per Channel: 16mA; Input Offset Voltage (Vos): 150uV; Bandwidth: 1MHz; Supply Current: 200uA; Input Bias Current: 65nA; Max Dual Supply Voltage: 18V; Max Supply Voltage: 36V; Min Supply Voltage: 2.7V; Voltage Gain: 60dB; Slew Rate: 1V/µs; Min Dual Supply Voltage: 1.35V; Number of Elements: 1; Series: -; Number of Pins: 8; Lead Free: Lead Free; Output Current: 16mA; REACH SVHC: No SVHC; Min Operating Temperature: -40°C; Quiescent Current: 200uA; Nominal Supply Current: 200uA; Max Operating Temperature: 125°C; RoHS Compliant: Yes; Case/Package: D; -3db Bandwidth: 1MHz; Radiation Hardening: No; Operating Supply Current: 200uA; Packaging: Tape and Reel; Package Quantity: 1; Number of Amplifiers: 1; Number of Channels: 1
Y? = CMP-27762-013691-1: Crystal 8MHz ±20ppm 8pF SMD-2 6mm x 3.5mm; ESR (Equivalent Series Resistance): 80R; Frequency Stability: 30ppm; Case/Package: SMD/SMT; Load Capacitance: 8pF; Packaging: Tape and Reel; Frequency Tolerance: 20ppm; Frequency: 8MHz; Mount: Surface Mount; Max Operating Temperature: 85°C; Min Operating Temperature: -40°C